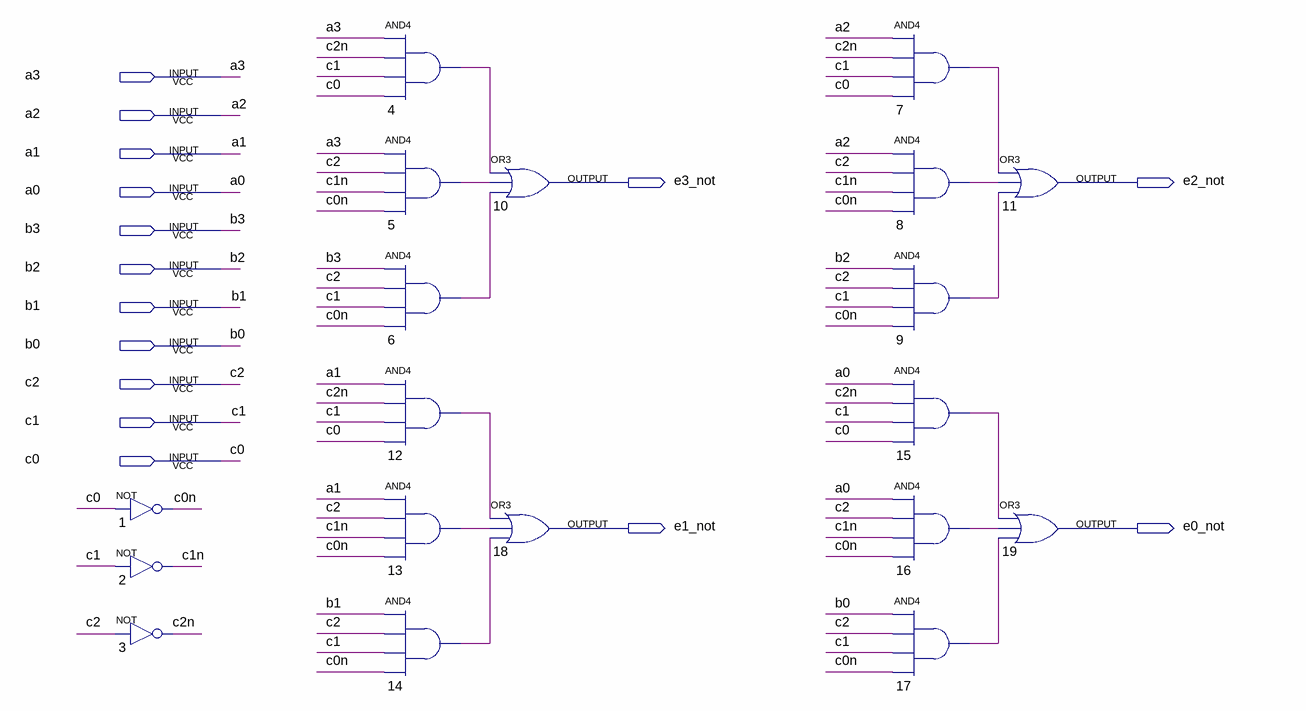
[diagram p0: schematic sheet]
// Quartus schematic mux_not.bdf as structural Verilog: 19 symbols, 15 pins
module mux_not (
  input  a3,
  input  a2,
  input  a1,
  input  a0,
  input  b3,
  input  b2,
  input  b1,
  input  b0,
  input  c2,
  input  c1,
  input  c0,
  output e3_not,
  output e2_not,
  output e1_not,
  output e0_not
);

  wire c0n, c1n, c2n, n4_out, n5_out, n6_out, n7_out, n8_out, n9_out, n12_out, n13_out, n14_out, n15_out,
       n16_out, n17_out;

  not u_1 (c0n, c0);
  not u_2 (c1n, c1);
  not u_3 (c2n, c2);
  and u_4 (n4_out, a3, c2n, c1, c0);
  and u_5 (n5_out, a3, c2, c1n, c0n);
  and u_6 (n6_out, b3, c2, c1, c0n);
  and u_12 (n12_out, a1, c2n, c1, c0);
  and u_13 (n13_out, a1, c2, c1n, c0n);
  and u_14 (n14_out, b1, c2, c1, c0n);
  or u_10 (e3_not, n4_out, n5_out, n6_out);
  or u_18 (e1_not, n12_out, n13_out, n14_out);
  and u_7 (n7_out, a2, c2n, c1, c0);
  and u_8 (n8_out, a2, c2, c1n, c0n);
  and u_9 (n9_out, b2, c2, c1, c0n);
  and u_15 (n15_out, a0, c2n, c1, c0);
  and u_16 (n16_out, a0, c2, c1n, c0n);
  and u_17 (n17_out, b0, c2, c1, c0n);
  or u_11 (e2_not, n7_out, n8_out, n9_out);
  or u_19 (e0_not, n15_out, n16_out, n17_out);
endmodule
